# EasyEDA Pro project ProPrj_主板-智能视觉_2026-04-17.epro

# Schematic Schematic1
Board Name: Board1; Create Date: 2026-01-07; Page Name: P1; Project Name: 主板-智能视觉; Schematic Name: Schematic1; Update Date: 2026-04-12; Company: 嘉立创EDA; Page Size: A4; Version: V1.0
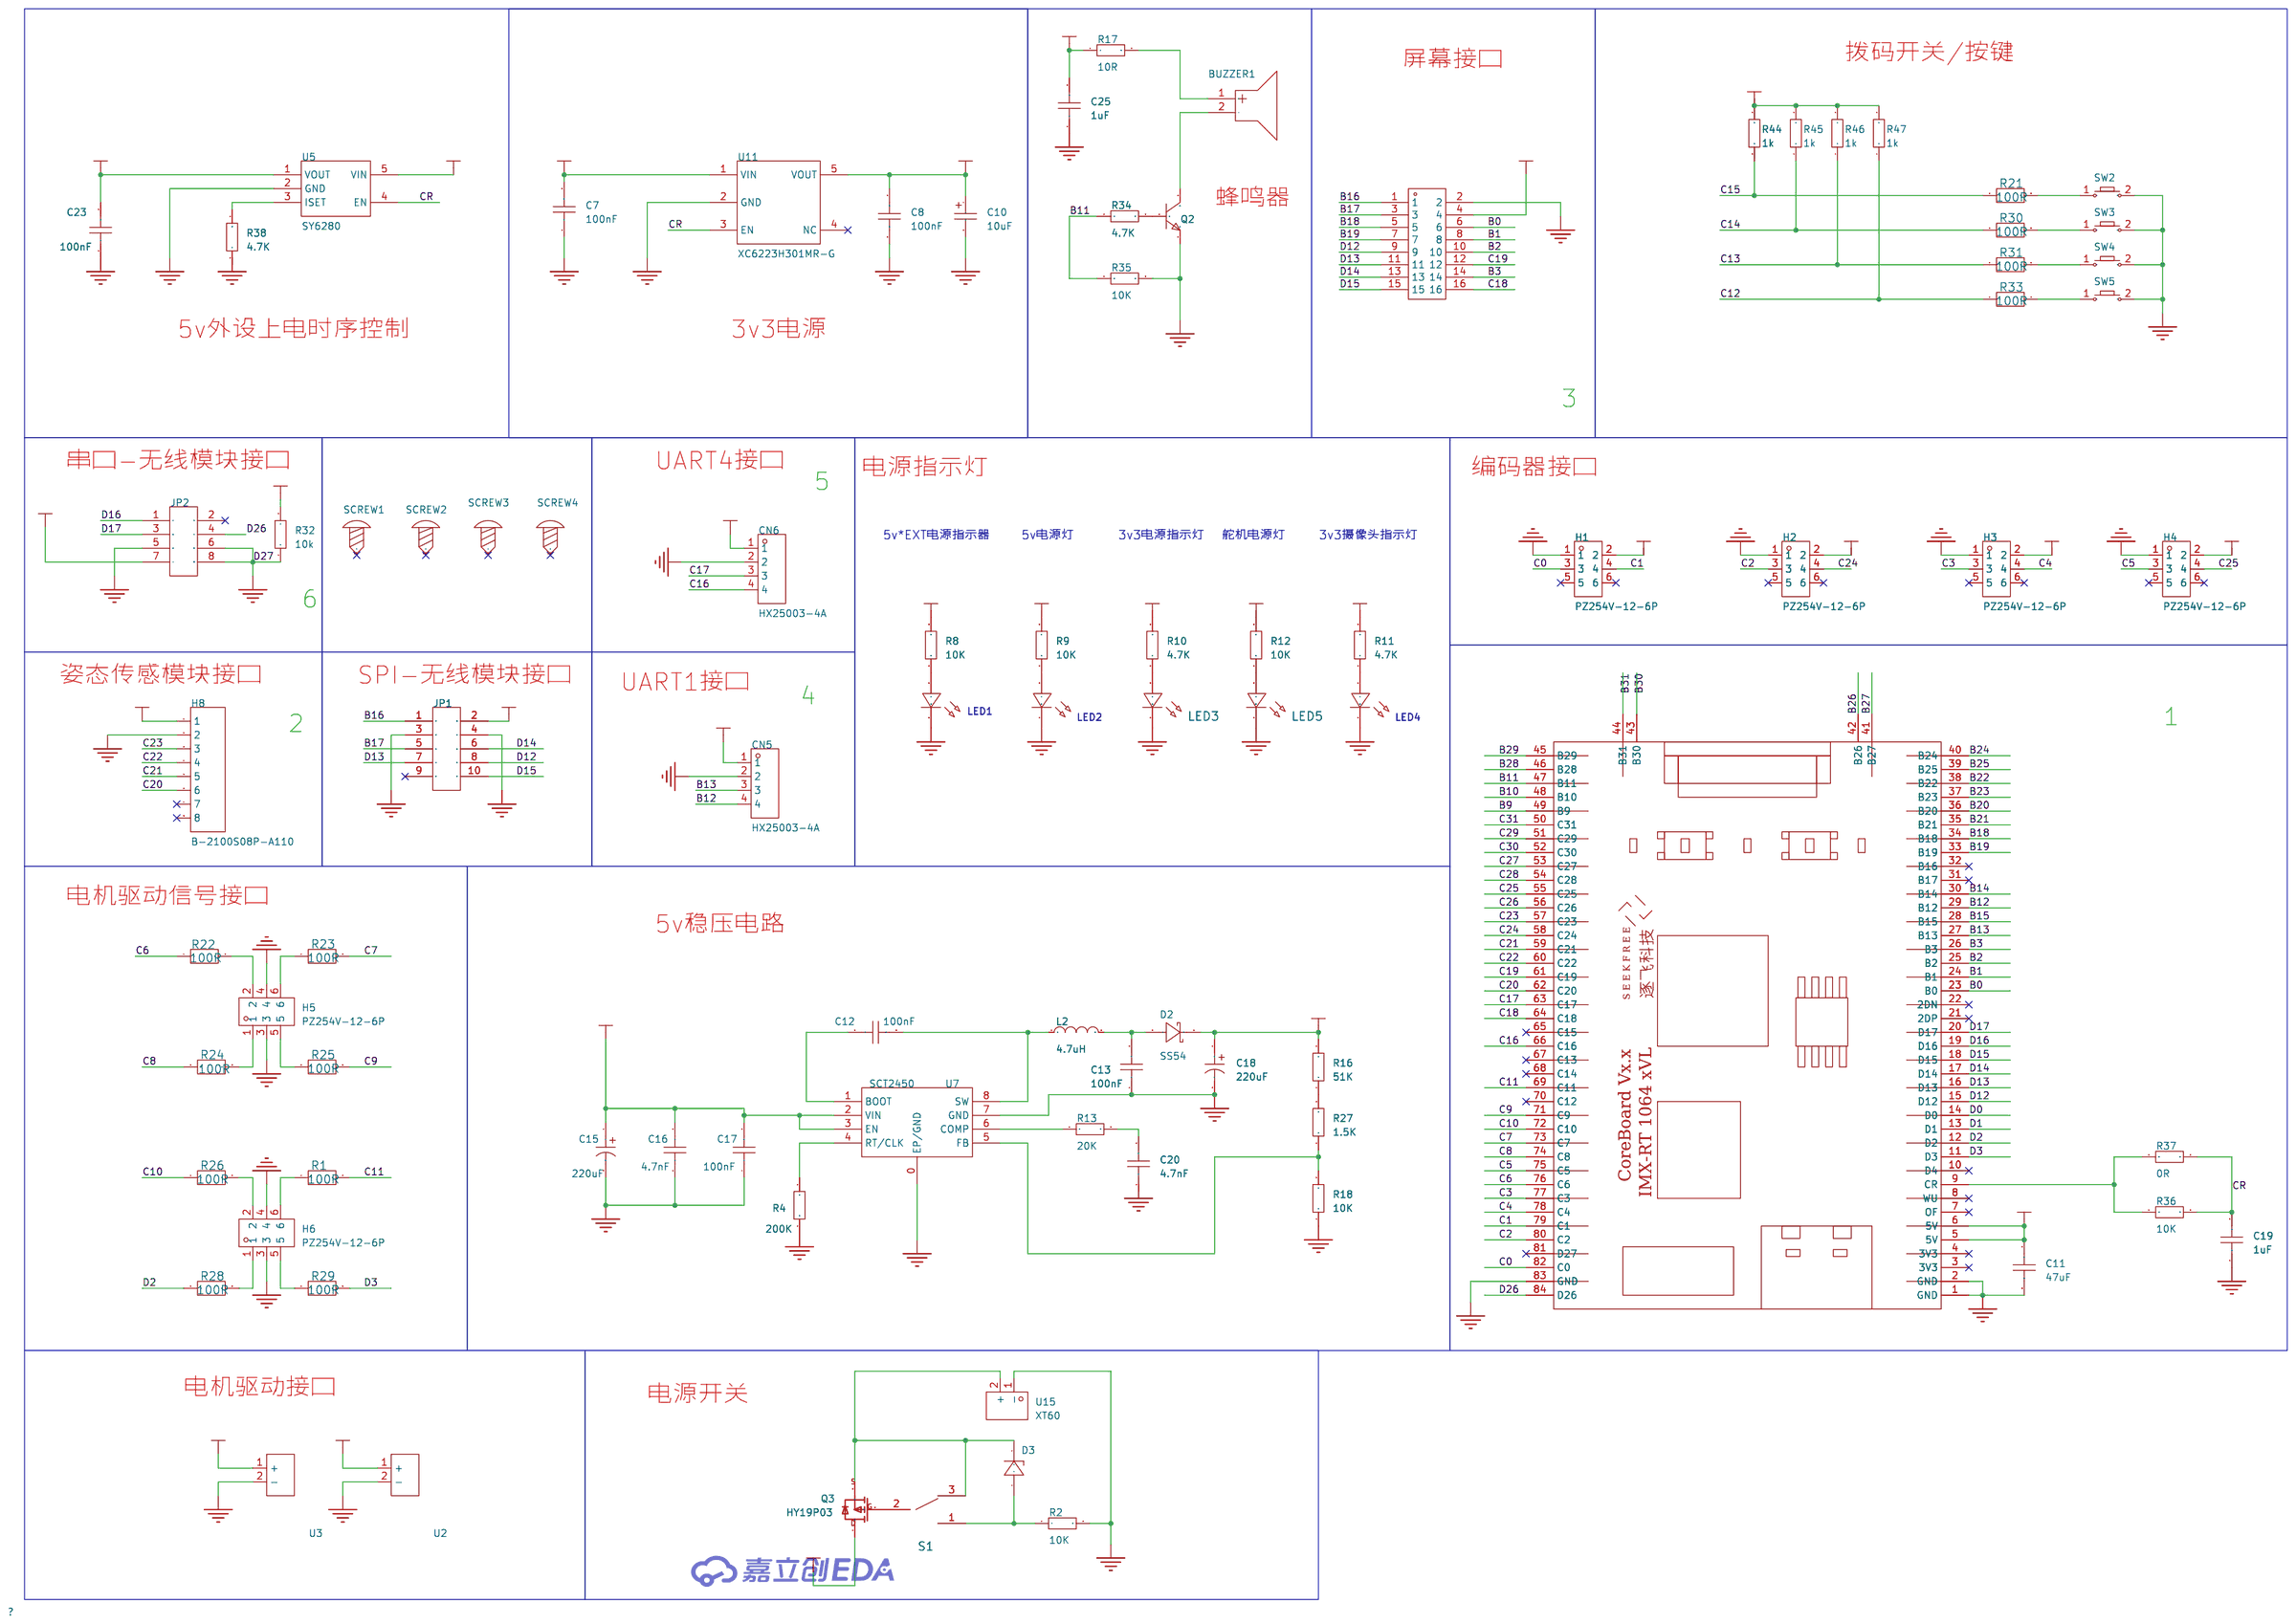
[diagram p0: schematic sheet]

## Parts
BUZZER1  5V,管脚间距8mm,外径10mm,高9.5mm  [BUZ-TH_BD12.0-P7.60-D0.6-FD]
C7  100nF  [C0603]
C8  100nF  [C0603]
C10  10uF  [CAP-SMD_L3.2-W1.6-RD-C7171]
C11  47uF  [C0603]
C12  100nF  [C0603]
C13  100nF  [C1206]
C15  220uF  [CAP-SMD_BD8.0-L8.3-W8.3-LS9.0-FD]
C16  4.7nF  [C1206]
C17  100nF  [C0603]
C18  220uF  [CAP-SMD_BD8.0-L8.3-W8.3-LS9.0-FD]
C19  1uF  [C0603]
C20  4.7nF  [C0603]
C23  100nF  [C0603]
C25  1uF  [C0603]
CN5  HX25003-4A  [CONN-TH_4P-P2.50_HX25003-4A]
CN6  HX25003-4A  [CONN-TH_4P-P2.50_HX25003-4A]
D2  SS54  [SMA_L4.2-W2.6-LS5.1-RD]
D3  BZT52C16  [SOD-123-L]
H1  PZ254V-12-6P  [HDR-TH_6P-P2.54-V-M-R2-C3-S2.54]
H2  PZ254V-12-6P  [HDR-TH_6P-P2.54-V-M-R2-C3-S2.54]
H3  PZ254V-12-6P  [HDR-TH_6P-P2.54-V-M-R2-C3-S2.54]
H4  PZ254V-12-6P  [HDR-TH_6P-P2.54-V-M-R2-C3-S2.54]
H5  PZ254V-12-6P  [HDR-TH_6P-P2.54-V-M-R2-C3-S2.54]
H6  PZ254V-12-6P  [HDR-TH_6P-P2.54-V-M-R2-C3-S2.54]
H7  8×2针双排母  [8×2针双排母_MSK_V1]
H8  B-2100S08P-A110  [HDR-TH_8P-P2.54-V-M]
JP1  2.54排母双排2*5P  [HDR2.54-LI-2x5P]
JP2  2.54排母双排2*4P  [HDR2.54-LI-2x4P]
L2  4.7uH  [IND-SMD_L7.1-W6.6_POHS0603]
LED1  -  [LED_0603]
LED2  -  [LED_0603]
LED3  -  [LED_0603]
LED4  -  [LED_0603]
LED5  -  [LED_0603]
Q2  -  [S8050_TO_92]
Q3  HY19P03  [TO-252AA]
R1  100R  [R0603]
R2  10K  [R0603]
R4  200K  [R0603]
R8  10K  [R0603]
R9  10K  [R0603]
R10  4.7K  [R0603]
R11  4.7K  [R0603]
R12  10K  [R0603]
R13  20K  [R0603]
R16  51K  [R0603]
R17  10R  [R0603]
R18  10K  [R0603]
R21  100R  [R0603]
R22  100R  [R0603]
R23  100R  [R0603]
R24  100R  [R0603]
R25  100R  [R0603]
R26  100R  [R0603]
R27  1.5K  [R0603]
R28  100R  [R0603]
R29  100R  [R0603]
R30  100R  [R0603]
R31  100R  [R0603]
R32  10k  [R0603]
R33  100R  [R0603]
R34  4.7K  [R0603]
R35  10K  [R0603]
R36  10K  [R0603]
R37  0R  [R0603]
R38  4.7K  [R0603]
R44  1k  [R0603]
R45  1k  [R0603]
R46  1k  [R0603]
R47  1k  [R0603]
S1  SW-SPDT  [SS12D10]
SCREW1  -  [M3螺丝]
SCREW2  -  [M3螺丝]
SCREW3  -  [M3螺丝]
SCREW4  -  [M3螺丝]
SW2  -  [Key_SMD_3x4x2]
SW3  -  [Key_SMD_3x4x2]
SW4  -  [Key_SMD_3x4x2]
SW5  -  [Key_SMD_3x4x2]
U2  -  [XT30]
U3  -  [XT30]
U5  SY6280  [SOT-23-5]
U7  SCT2450  [SOP-8E]
U11  XC6223H301MR-G  [SOT_235]
U15  XT60  [CONN-TH_XT60]
U?1  -  [AUFE_RT1064]

## Library data of the parts
BUZZER1 = 5V,管脚间距8mm,外径10mm,高9.5mm: Supplier Part: C9900017013; Supplier Footprint: BEEP; JLCPCB Part Class: 扩展库; Supplier: LCSC
C7 C8 C11 C12 C17 C19 C20 C23 C25 = CAP_0603: Supplier Footprint: 0603
C10 = TAJA106K016RNJ: 容值:10uF;精度:±10%;额定电压:16V;等效串联电阻(ESR):3Ω@100kHz;; LCSC Part Name: 10uF ±10% 16V; Supplier Part: C7171; Manufacturer: Kyocera AVX; Supplier Footprint: CASE-A-3216-18(mm); JLCPCB Part Class: 基础库; Supplier: LCSC; Tolerance: ±10%; Voltage Rating: 16V; Equivalent Series Resistance(ESR): 3Ω@100kHz; Operating Temperature: -55℃~+125℃
C13 C16 = CAP_1206: Supplier Footprint: 1206
C15 C18 = RYRVT25V220UF8*10: 容值:220uF;精度:±20%;额定电压:25V;纹波电流:183mA@120Hz;; LCSC Part Name: 220uF ±20% 25V; Supplier Part: C48970746; Manufacturer: HONOR(荣誉); Supplier Footprint: SMD,D8xL10.2mm; JLCPCB Part Class: 扩展库; Datasheet: https://item.szlcsc.com/datasheet/RYRVT25V220UF8*10/51295690.html; Supplier: LCSC; Tolerance: ±20%; Voltage Rating: 25V; Ripple Current: 183mA@120Hz; Diameter: 8mm; Height - Seated (Max): 10.2mm; Lifetime: 2000hrs@105℃; Operating Temperature: -55℃~+105℃
CN5 CN6 = HX25003-4A: 参考系列:XH;间距:2.5mm;插针结构:1x4P;排数:1;每排PIN数:4;行距:-;公母:公型插针;安装方式:直插;额定电流:-;工作温度范围:-;; LCSC Part Name: 母座 直插/直针 2.5mm 4Pin位; Supplier Part: C442301; Manufacturer: HX(红星); Supplier Footprint: 插件,P=2.5mm; JLCPCB Part Class: Extended Part; Datasheet: https://atta.szlcsc.com/upload/public/pdf/source/20191028/C442301_3A3D3A554E5F0CBC5D03B496CD495BC6.pdf; Supplier: LCSC; Reference Series: XH; Pitch: 2.5mm; Pins Structure: 1x4P; Number of Rows: 1; Number of PINs Per Row: 4; Gender: 公型插针; Mounting Style: 直插
D2 = SS54: Supplier Part: C9900023219; Supplier Footprint: (1N5824)DO-214; JLCPCB Part Class: 扩展库; Supplier: LCSC
D3 = BZT52C16: Published: 8-Jun-2000; Revision: July-2002: Re-released for DXP Platform.; Publisher: Altium Limited; Price(RMB): 0.000; Origin Footprint 2: DIODE-0.7; Origin Footprint 3: DIODE-0.4; Origin Footprint 4: SOD-87[LL-41]; Origin Footprint 5: CD4521-1808; Origin Footprint 6: SOD-80[LL-34]; Origin Footprint 7: SOD-123-FL; Origin Footprint 8: SOD-123-M; Origin Footprint 9: SOD-323; Origin Footprint 10: SOD-523-L; Origin Footprint 11: SOD-523-M
H1-H6 = PZ254V-12-6P: 插针结构:2x3P;间距:2.54mm;行距:2.54mm;圆针/方针:方针;安装类型:直插;排数:双排;总PIN位数:6P;额定电流:-;额定电压:-;配合针长度:6mm;塑高:2.5mm;端接针长度:3mm;触头材质:黄铜;触头镀层:-;工作温度范围:-40℃~+105℃;颜色:黑色;; LCSC Part Name: 间距:2.54mm 2x3P 直插 方针; Supplier Part: C492420; Manufacturer: XFCN(兴飞); Supplier Footprint: 插件,P=2.54mm; JLCPCB Part Class: 扩展库; Datasheet: https://atta.szlcsc.com/upload/public/pdf/source/20200309/C492420_BAECB307B001054C09D200388220EAE6.pdf; Supplier: LCSC; Pin Structure: 2x3P; Pitch: 2.54mm; Row Spacing: 2.54mm; Circluar Pins/Square Pins: 方针; Mounting Type: 直插; Number of Rows: 双排; Number of Pins: 6P; Length of Mating Pin: 6mm; Insulation Height: 2.5mm; Length of End Connection Pin: 3mm; Contact Material: 黄铜; Operating Temperature Range: -40℃~+105℃; Color: 黑色
H7 = 8×2针双排母
H8 = B-2100S08P-A110: 插针结构:1x8P;间距:2.54mm;行距:-;圆针/方针:方针;安装方式:直插;排数:单排;总PIN位数:8P;额定电流:3A;额定电压:-;配合针长度:6mm;塑高:2.54mm;端接针长度:3mm;触头材质:黄铜;触头镀层:-;工作温度:-40℃~+105℃;颜色:黑色;; LCSC Part Name: 1x8P 间距:2.54mm 方针 直插; Supplier Part: C124381; Manufacturer: Ckmtw(灿科盟); Supplier Footprint: 插件,P=2.54mm; JLCPCB Part Class: 扩展库; Datasheet: https://item.szlcsc.com/datasheet/B-2100S08P-A110/125656.html; Supplier: LCSC; Pin Structure: 1x8P; Pitch: 2.54mm; Circluar Pins/Square Pins: 方针; Mounting Type: 直插; Number of Rows: 单排; Number of Pins: 8P; Current Rating: 3A; Length of Mating Pin: 6mm; Insulation Height: 2.54mm; Length of End Connection Pin: 3mm; Contact Material: 黄铜; Operating Temperature: -40℃~+105℃; Color: 黑色
JP1 = 2.54排母双排2*5P
JP2 = 2.54排母双排2*4P
L2 = POHS0603-4R7M: 电感值:4.7uH;精度:±20%;额定电流:5A;饱和电流(Isat):8A;类型:一体成型电感;; LCSC Part Name: 功率电感; Supplier Part: C49333010; Manufacturer: HYHONGYEX(宏业); Supplier Footprint: SMD,7.1x6.6mm; JLCPCB Part Class: 扩展库; Datasheet: https://item.szlcsc.com/datasheet/POHS0603-4R7M/51817416.html; Supplier: LCSC; Tolerance: ±20%; Current Rating: 5A; Current - Saturation(Isat): 8A; DC Resistance(DCR): 40mΩ; Type: 一体成型电感
LED1 LED4 = LED_0603-G: Supplier Footprint: 0603
LED2 = LED_0603-B: Supplier Footprint: 0603
LED3 LED5 = LED_0603-R: Supplier Footprint: 0603
Q2 = S8050_TO_NPN: Supplier Footprint: TO-92
Q3 = HY19P03: HY19P03 P-Channel MOSFET; componentDisplayMode: -1
R1 R21-R26 R28-R31 R33 = 100R
R2 R4 R8-R13 R16-R18 R27 R34-R38 = Res_0603: Supplier Footprint: 0603
R32 R44-R47 = R-10K-1%: 电阻类型:厚膜电阻;阻值:10kΩ;精度:±1%;功率:100mW;工作电压:75V;温度系数:±100ppm/℃;; Manufacturer: UNI-ROYAL(厚声); Manufacturer Part: 0603WAF1002T5E; Supplier: LCSC; Supplier Part: C25804; LCSC Part Name: 厚膜电阻 10kΩ ±1% 100mW; Supplier Footprint: 0603; JLCPCB Part Class: Basic Part; Datasheet: https://atta.szlcsc.com/upload/public/pdf/source/20200306/C422600_1E6D84923E4A46A82E41ADD87F860B5C.pdf; Type: 厚膜电阻; Tolerance: ±1%; Power(Watts): 100mW; Voltage-Supply(Max): 75V; Temperature Coefficient: ±100ppm/℃; Operating Temperature: -55℃~+155℃
S1 = SW-SPDT: Published: 24-Mar-1999; Publisher: Altium Limited; Price(RMB): 0.000
SCREW1-SCREW4 = M3螺丝: Supplier Footprint: 插件
SW2-SW5 = Key_SMD_3x4x2: Supplier Footprint: SMD
U2 U3 = XT30
U5 = SY6280: Published: 2020-12-08; Revision: V1.0; Imax: 2.1A
U7 = SCT2450
U11 = XC6223H301MR-G: 存货编码: 1110404156; 存货名称: 集成电路
U15 = XT60: 模型锂电连接器; LCSC Part Name: XT60公头（电调端）; Supplier Part: C98733; Manufacturer: AMASS(艾迈斯); Supplier Footprint: XT60-M; JLCPCB Part Class: 扩展库; Datasheet: https://atta.szlcsc.com/upload/public/pdf/source/20170606/1496716524919.pdf; Supplier: LCSC
U?1 = RT1064: Supplier: seekfree

## Nets
3V3: C8.2 C10.1 C25.2 H1.2 H2.2 H3.2 H4.2 H7.4 H8.1 R10.2 R17.1 R32.2 R44.2 R45.2 R46.2 R47.2 U11.5(VOUT)
GND: C7.1 C8.1 C10.2 C11.2 C13.1 C15.2 C16.1 C17.1 C18.2 C19.1 C20.1 C23.1 C25.1 CN5.2 CN6.2 H1.1 H2.1 H3.1 H4.1 H5.3 H5.4 H6.3 H6.4 H7.2 H8.2 JP1.3 JP1.4 JP2.5 JP2.6 LED1.1(C) LED2.1(C) LED3.1(C) LED4.1(C) LED5.1(C) Q2.1(E) R2.2 R4.1 R18.1 R35.2 R38.1 SW2.2 SW3.2 SW4.2 SW5.2 U2.2(-) U3.2(-) U5.2(GND) U7.0(EP/GND) U7.7(GND) U11.2(GND) U15.1(-) U?1.1(GND) U?1.2(GND) U?1.83(GND)
VCC-5V: C7.2 C11.1 C18.1 D2.1(C) R9.2 R16.2 U5.5(VIN) U11.1(VIN) U?1.5(5V) U?1.6(5V)
VCC-5V-EXT: C23.2 CN5.1 CN6.1 JP1.2 JP2.7 R8.2 U5.1(VOUT)
VCC_SERVO: R12.2
VCCBAT: C15.1 C16.2 C17.2 Q3.1(D) U2.1(+) U3.1(+) U7.2(VIN) U7.3(EN)
B0: H7.6 U?1.23(B0)
B1: H7.8 U?1.24(B1)
B2: H7.10 U?1.25(B2)
B3: H7.14 U?1.26(B3)
B9: U?1.49(B9)
B10: U?1.48(B10)
B11: R34.1 R35.1 U?1.47(B11)
B12: CN5.4 U?1.29(B12)
B13: CN5.3 U?1.27(B13)
B14: U?1.30(B14)
B15: U?1.28(B15)
B16: H7.1 JP1.1
B17: H7.3 JP1.5
B18: H7.5 U?1.34(B18)
B19: H7.7 U?1.33(B19)
B20: U?1.36(B20)
B21: U?1.35(B21)
B22: U?1.38(B22)
B23: U?1.37(B23)
B24: U?1.40(B24)
B25: U?1.39(B25)
B26: U?1.42(B26)
B27: U?1.41(B27)
B28: U?1.46(B28)
B29: U?1.45(B29)
B30: U?1.43(B30)
B31: U?1.44(B31)
C0: H1.3 U?1.82(C0)
C1: H1.4 U?1.79(C1)
C2: H2.3 U?1.80(C2)
C3: H3.3 U?1.77(C3)
C4: H3.4 U?1.78(C4)
C5: H4.3 U?1.75(C5)
C6: R22.1 U?1.76(C6)
C7: R23.2 U?1.73(C7)
C8: R24.1 U?1.74(C8)
C9: R25.2 U?1.71(C9)
C10: R26.1 U?1.72(C10)
C11: R1.2 U?1.69(C11)
C12: R33.1 R47.1
C13: R31.1 R46.1
C14: R30.1 R45.1
C15: R21.1 R44.1
C16: CN6.4 U?1.66(C16)
C17: CN6.3 U?1.63(C17)
C18: H7.16 U?1.64(C18)
C19: H7.12 U?1.61(C19)
C20: H8.6 U?1.62(C20)
C21: H8.5 U?1.59(C21)
C22: H8.4 U?1.60(C22)
C23: H8.3 U?1.57(C23)
C24: H2.4 U?1.58(C24)
C25: H4.4 U?1.55(C25)
C26: U?1.56(C26)
C27: U?1.53(C27)
C28: U?1.54(C28)
C29: U?1.51(C29)
C30: U?1.52(C30)
C31: U?1.50(C31)
CR: C19.2 R36.2 R37.2 U5.4(EN) U11.3(EN)
CSI-3V3: R11.2
D0: U?1.14(D0)
D1: U?1.13(D1)
D2: R28.1 U?1.12(D2)
D3: R29.2 U?1.11(D3)
D12: H7.9 JP1.8 U?1.15(D12)
D13: H7.11 JP1.7 U?1.16(D13)
D14: H7.13 JP1.6 U?1.17(D14)
D15: H7.15 JP1.10 U?1.18(D15)
D16: JP2.1 U?1.19(D16)
D17: JP2.3 U?1.20(D17)
D26: JP2.4 U?1.84(D26)
D27: JP2.8 R32.1
$1N3992: R21.2 SW2.1
$1N3996: R30.2 SW3.1
$1N4004: R31.2 SW4.1
$1N4009: R33.2 SW5.1
$1N8072: R38.2 U5.3(ISET)
$1N10416: R4.2 U7.4(RT/CLK)
$1N10423: C12.1 U7.1(BOOT)
$1N10427: C12.2 L2.1 U7.8(SW)
$1N10446: C20.2 R13.2
$1N10453: R18.2 R27.1 U7.5(FB)
$1N10461: R13.1 U7.6(COMP)
$1N10501: R16.1 R27.2
$1N10556: C13.2 D2.2(A) L2.2
$1N13494: BUZZER1.1(+) R17.2
$1N13753: Q2.2(B) R34.2
$1N13767: BUZZER1.2(-) Q2.3(C)
$1N14655: D3.A R2.1 S1.1
$1N20848: R36.1 R37.1 U?1.9(CR)
$1N26305: Q3.2(G) S1.2
Net-(D3-K): D3.K Q3.3(S) S1.3 U15.2(+)
Net-(H5-1): H5.1 R24.2
Net-(H5-2): H5.2 R22.2
Net-(H5-5): H5.5 R25.1
Net-(H5-6): H5.6 R23.1
Net-(H6-1): H6.1 R28.2
Net-(H6-2): H6.2 R26.2
Net-(H6-5): H6.5 R29.1
Net-(H6-6): H6.6 R1.1
Net-(LED1-2): LED1.2(A) R8.1
Net-(LED2-2): LED2.2(A) R9.1
Net-(LED3-2): LED3.2(A) R10.1
Net-(LED4-2): LED4.2(A) R11.1
Net-(LED5-2): LED5.2(A) R12.1

Not connected (* = marked no-connect by the designer): H1 5* 6*; H2 5* 6*; H3 5* 6*; H4 5* 6*; H8 7* 8*; JP1 9*; JP2 2*; SCREW1 1*; SCREW2 1*; SCREW3 1*; SCREW4 1*; U11 4(NC)*; U?1 3(3V3)* 4(3V3)* 7(OF)* 8(WU)* 10(D4)* 21(2DP)* 22(2DN)* 31(B17)* 32(B16)* 65(C15)* 67(C13)* 68(C14)* 70(C12)* 81(D27)*

## Notes on the sheet
- 拨码开关/按键
- 屏幕接口
- 蜂鸣器
- 5v外设上电时序控制
- 3v3电源
- 3
- 串口-无线模块接口
- UART4接口
- 电源指示灯
- 编码器接口
- 5
- 5v*EXT电源指示器
- 5v电源灯
- 3v3电源指示灯
- 舵机电源灯
- 3v3摄像头指示灯
- 6
- 姿态传感模块接口
- SPI-无线模块接口
- UART1接口
- 4
- 2
- 1
- 电机驱动信号接口
- 5v稳压电路
- 电机驱动接口
- 电源开关

# Board PCB1
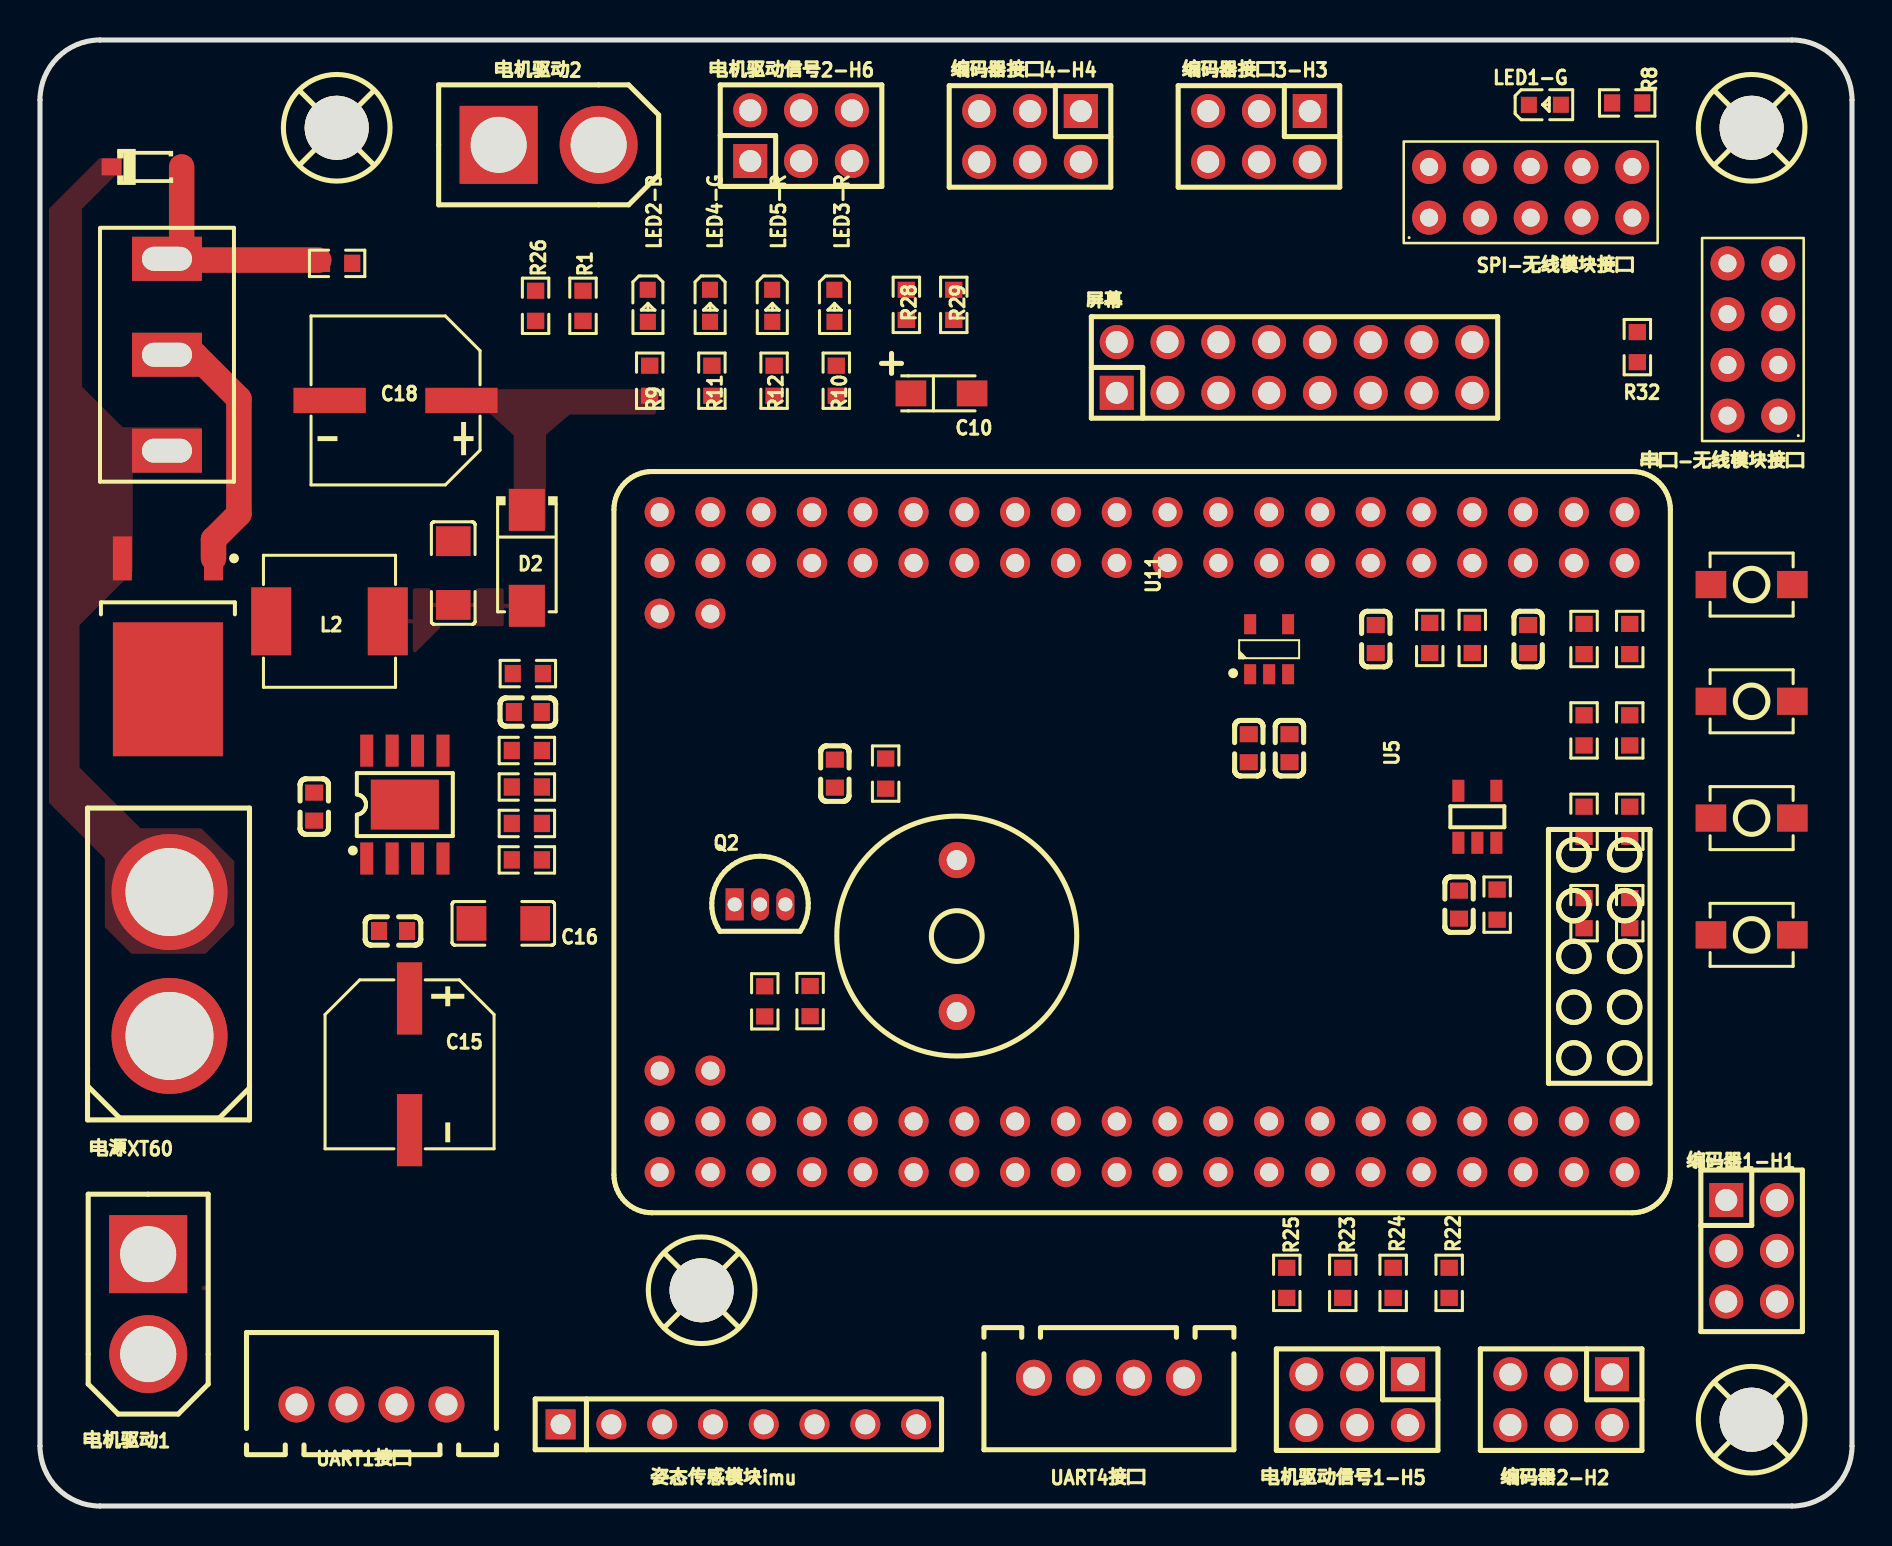
[diagram p1: board, top side]
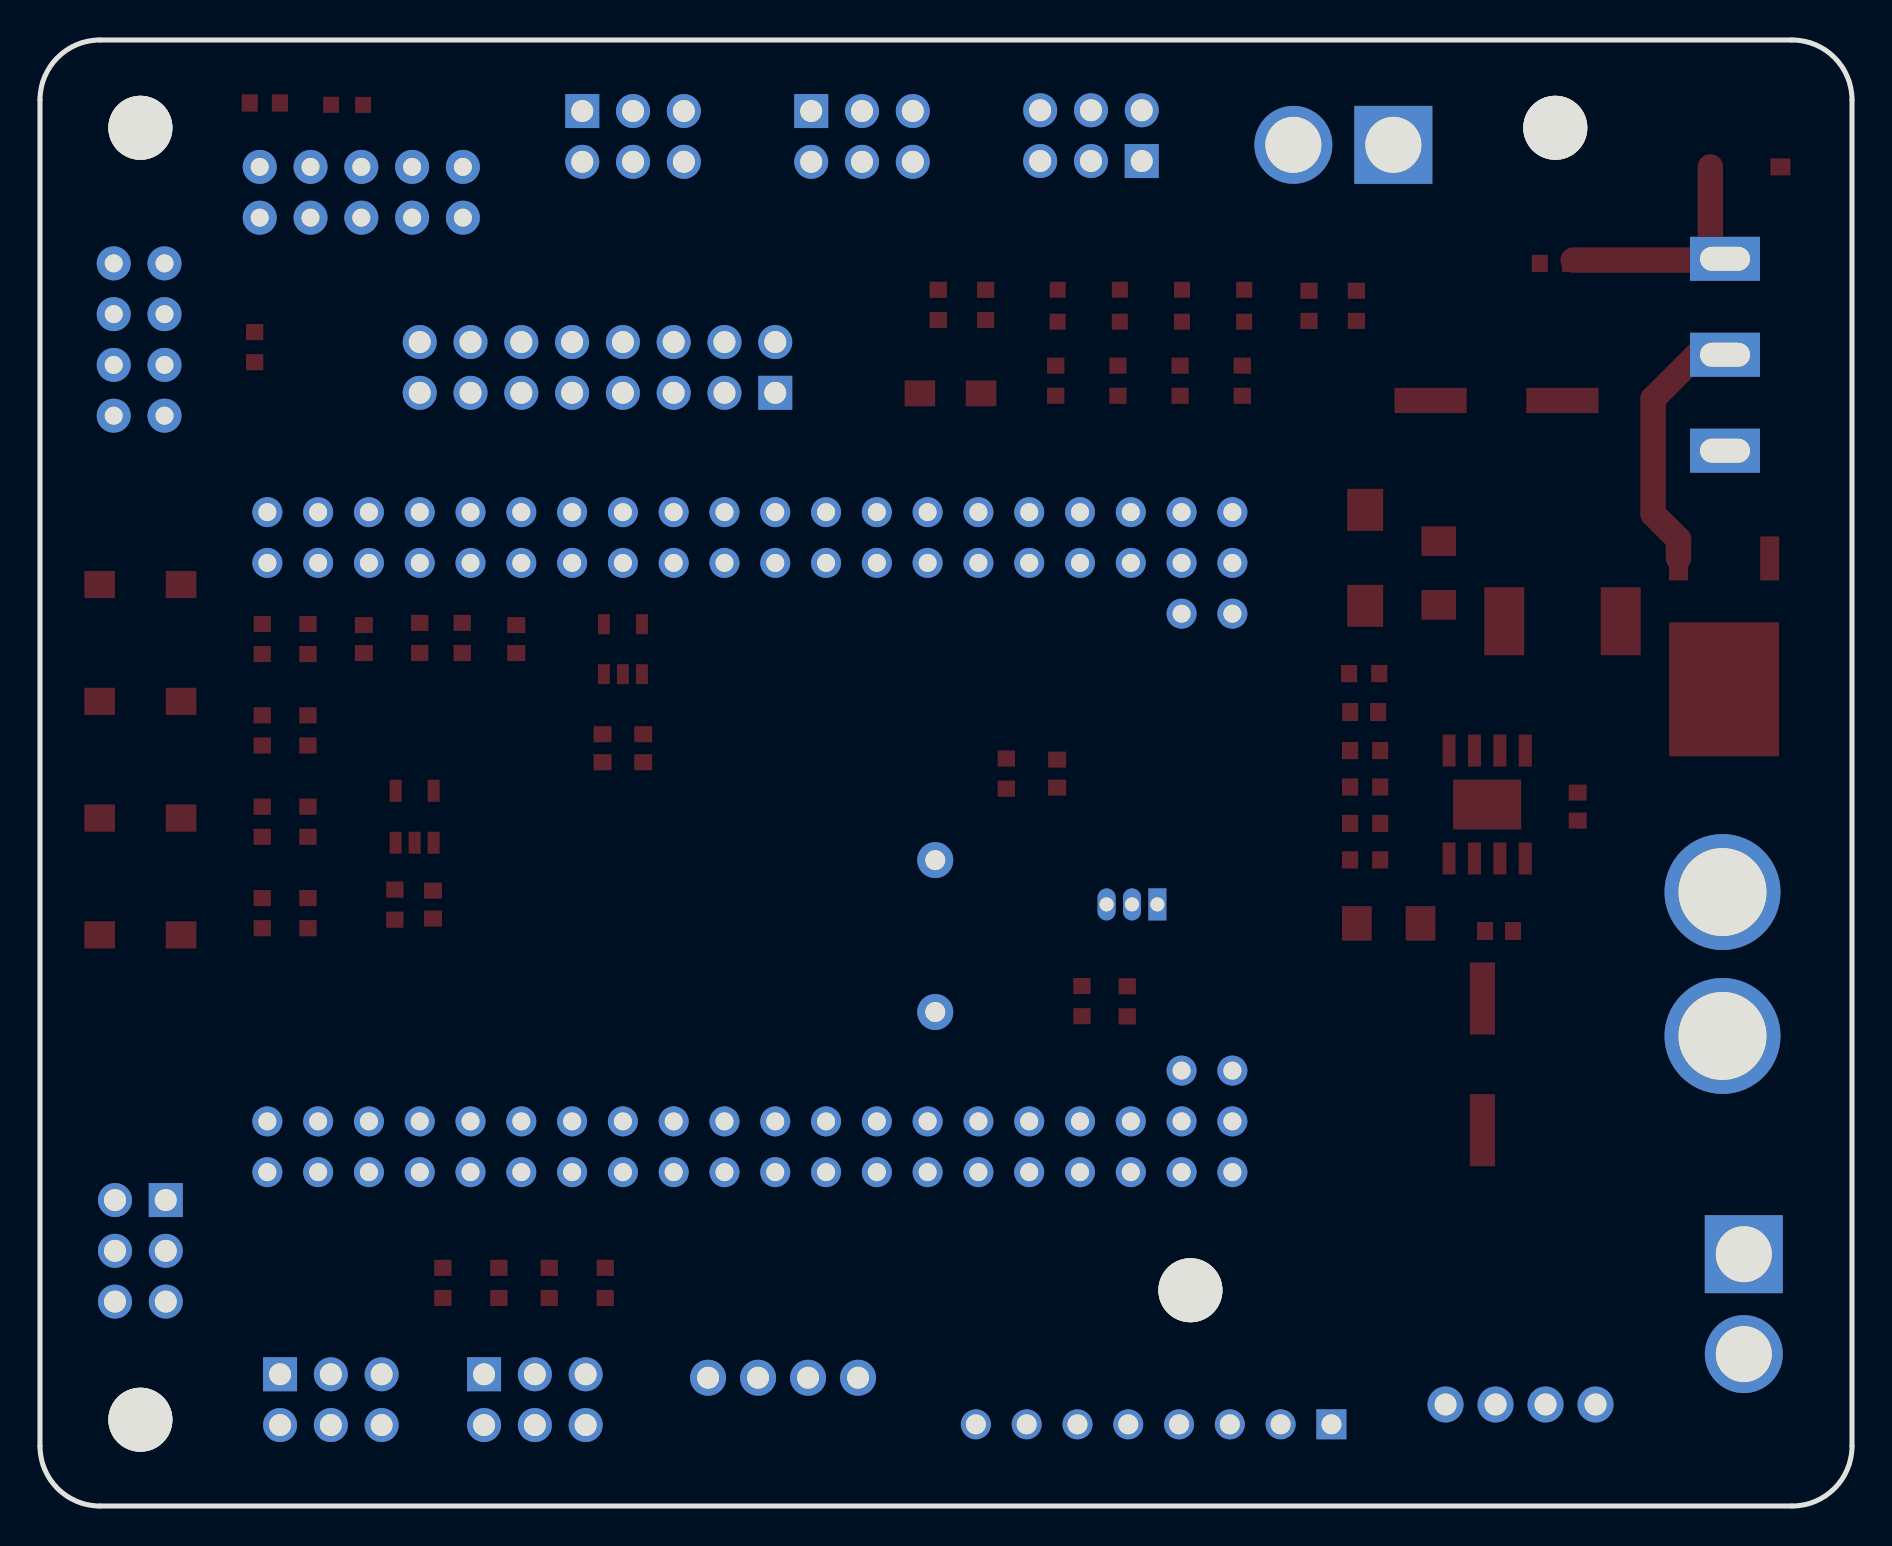
[diagram p2: board, bottom side, seen from below]

Outline 90.62 x 73.35 mm; copper layers: Top Layer, 电源层, GND层, Bottom Layer. Coordinates in mm from the lower left corner of the outline.
Outline path: 0,70.35 0,3 arc(0.88,0.88) 3,0 87.62,0 arc(89.74,0.88) 90.62,3 90.62,70.35 arc(89.74,72.47) 87.62,73.35 3,73.35 arc(0.88,72.47) 0,70.35
Stack: Top Layer 0.035mm 外层铜厚1oz / Dielectric1 0.2104mm 7628 RC49% 8.6mil / 电源层 0.0152mm 内层铜厚 / Dielectric2 1.065mm 1.1mm H/HOZ Copper / GND层 0.0152mm 内层铜厚 / Dielectric3 0.2104mm 7628 RC49% 8.6mil / Bottom Layer 0.035mm 外层铜厚1oz

## Design rules (mm)
template: 自定义配置
spacing copperThickness1oz (default): track to track 0.102, other pairs 0.152 to 0.3
spacing copperThickness2oz: track to track 0.203, other pairs 0.152 to 0.3
track width copperThickness1oz (default): min 0.127, default 0.254, max 2.54
track width copperThickness2oz: min 0.203, default 0.254, max 2.54
differential pair differentialPair (default): width min 0.127, default 0.254, max 2.54; gap min 0.152, default 0.152
via viaSize (default): diameter min 0.5, default 0.61, max 10; hole min 0.3, default 0.305, max 6.3
net VCCBAT uses copperRegion1
net VCC-5V uses copperRegion1
net $1N14471 uses copperRegion1

## Placement (name value [footprint] x y rotation side)
BUZZER1  5V,管脚间距8mm,外径10mm,高9.5mm  [BUZ-TH_BD12.0-P7.60-D0.6-FD]  45.85 28.52 270 top
C7  100nF  [C0603]  60.45 37.91 90 top
C8  100nF  [C0603]  62.48 37.91 90 top
C10  10uF  [CAP-SMD_L3.2-W1.6-RD-C7171]  45.09 55.67 0 top
C11  47uF  [C0603]  74.42 43.37 270 top
C12  100nF  [C0603]  13.72 34.99 90 top
C13  100nF  [C1206]  20.67 46.68 270 top
C15  220uF  [CAP-SMD_BD8.0-L8.3-W8.3-LS9.0-FD]  18.48 22.1 270 top
C16  4.7nF  [C1206]  23.17 29.15 180 top
C17  100nF  [C0603]  17.65 28.77 0 top
C18  220uF  [CAP-SMD_BD8.0-L8.3-W8.3-LS9.0-FD]  17.78 55.31 180 top
C19  1uF  [C0603]  66.8 43.37 270 top
C20  4.7nF  [C0603]  24.4 39.72 0 top
C23  100nF  [C0603]  70.97 30.09 90 top
C25  1uF  [C0603]  39.75 36.64 90 top
D2  SS54  [SMA_L4.2-W2.6-LS5.1-RD]  24.35 47.44 270 top
D3  BZT52C16  [SOD-123-L]  5.33 67 180 top
L2  4.7uH  [IND-SMD_L7.1-W6.6_POHS0603]  14.48 44.26 0 top
LED1-G  -  [LED_0603]  75.31 70.11 0 top
LED2-B  -  [LED_0603]  30.4 60 270 top
LED3-R  -  [LED_0603]  39.73 60 270 top
LED4-G  -  [LED_0603]  33.51 60 270 top
LED5-R  -  [LED_0603]  36.62 60 270 top
Q2  -  [S8050_TO_92]  36.01 30.1 0 top
Q3  HY19P03  [TO-252AA]  6.4 44.14 270 top
R1  100R  [R0603]  27.16 60.05 270 top
R2  10K  [R0603]  14.86 62.17 0 top
R4  200K  [R0603]  24.35 32.33 180 top
R8  10K  [R0603]  79.38 70.2 0 top
R9  10K  [R0603]  30.49 56.3 270 top
R10  4.7K  [R0603]  39.82 56.3 270 top
R11  4.7K  [R0603]  33.6 56.3 270 top
R12  10K  [R0603]  36.71 56.3 270 top
R13  20K  [R0603]  24.4 41.65 0 top
R16  51K  [R0603]  24.35 37.8 0 top
R17  10R  [R0603]  42.29 36.64 270 top
R18  10K  [R0603]  24.35 34.15 180 top
R21  100R  [R0603]  79.5 43.38 270 top
R22  100R  [R0603]  70.47 11.16 270 top
R23  100R  [R0603]  65.15 11.16 90 top
R24  100R  [R0603]  67.67 11.16 270 top
R25  100R  [R0603]  62.35 11.16 90 top
R26  100R  [R0603]  24.78 60.05 90 top
R27  1.5K  [R0603]  24.35 35.97 0 top
R28  100R  [R0603]  43.33 60.09 90 top
R29  100R  [R0603]  45.7 60.09 270 top
R30  100R  [R0603]  79.5 38.8 270 top
R31  100R  [R0603]  79.5 34.23 270 top
R32  10k  [R0603]  79.88 57.98 270 top
R33  100R  [R0603]  79.5 29.66 270 top
R34  4.7K  [R0603]  36.25 25.25 90 top
R35  10K  [R0603]  38.51 25.26 90 top
R36  10K  [R0603]  69.5 43.43 270 top
R37  0R  [R0603]  71.63 43.43 270 top
R38  4.7K  [R0603]  72.87 30.09 90 top
R44  1k  [R0603]  77.22 43.38 270 top
R45  1k  [R0603]  77.22 38.8 270 top
R46  1k  [R0603]  77.22 34.23 270 top
R47  1k  [R0603]  77.22 29.66 270 top
S1  SW-SPDT  [SS12D10]  6.35 57.6 270 top
SCREW1  -  [M3螺丝]  33.09 10.8 0 top
SCREW2  -  [M3螺丝]  85.6 4.32 0 top
SCREW3  -  [M3螺丝]  14.84 68.95 0 top
SCREW4  -  [M3螺丝]  85.6 68.95 0 top
SPI-无线模块接口  2.54排母双排2*5P  [HDR2.54-LI-2x5P]  74.55 65.73 0 top
SW2  -  [Key_SMD_3x4x2]  85.6 46.1 0 top
SW3  -  [Key_SMD_3x4x2]  85.6 40.26 0 top
SW4  -  [Key_SMD_3x4x2]  85.6 34.42 0 top
SW5  -  [Key_SMD_3x4x2]  85.6 28.58 0 top
U5  SY6280  [SOT-23-5]  71.88 34.48 90 top
U7  SCT2450  [SOP-8E]  18.25 35.09 90 top
U11  XC6223H301MR-G  [SOT_235]  61.47 42.87 90 top
U?1  -  [AUFE_RT1064]  55.12 33.21 180 top
UART1接口  HX25003-4A  [CONN-TH_4P-P2.50_HX25003-4A]  16.58 5.08 180 top
UART4接口  HX25003-4A  [CONN-TH_4P-P2.50_HX25003-4A]  53.46 6.42 0 top
串口-无线模块接口  2.54排母双排2*4P  [HDR2.54-LI-2x4P]  85.66 58.36 90 top
姿态传感模块imu  B-2100S08P-A110  [HDR-TH_8P-P2.54-V-M]  34.93 4.09 0 top
屏幕  8×2针双排母  [8×2针双排母_MSK_V1]  62.74 56.96 0 top
电机驱动1  -  [XT30]  5.41 10.1 270 top
电机驱动2  -  [XT30]  25.44 68.1 0 top
电机驱动信号1-H5  PZ254V-12-6P  [HDR-TH_6P-P2.54-V-M-R2-C3-S2.54]  65.87 5.32 180 top
电机驱动信号2-H6  PZ254V-12-6P  [HDR-TH_6P-P2.54-V-M-R2-C3-S2.54]  38.06 68.56 0 top
电源XT60  XT60  [CONN-TH_XT60]  6.48 27.12 90 top
编码器1-H1  PZ254V-12-6P  [HDR-TH_6P-P2.54-V-M-R2-C3-S2.54]  85.6 12.77 270 top
编码器2-H2  PZ254V-12-6P  [HDR-TH_6P-P2.54-V-M-R2-C3-S2.54]  76.07 5.32 180 top
编码器接口3-H3  PZ254V-12-6P  [HDR-TH_6P-P2.54-V-M-R2-C3-S2.54]  60.96 68.52 180 top
编码器接口4-H4  PZ254V-12-6P  [HDR-TH_6P-P2.54-V-M-R2-C3-S2.54]  49.51 68.52 180 top

## Footprints (pads in the part's own frame, mm; a bottom-side part is the same pattern mirrored in y, then rotated)
8×2针双排母_MSK_V1
  rect 1.7x1.7 hole 1.1: 1(-8.89,-1.27)
  round 1.7 hole 1.1: 2(-8.89,1.27) 3(-6.35,-1.27) 4(-6.35,1.27) 5(-3.81,-1.27) 6(-3.81,1.27) 7(-1.27,-1.27) 8(-1.27,1.27) 9(1.27,-1.27) 10(1.27,1.27) 11(3.81,-1.27) 12(3.81,1.27) 13(6.35,-1.27) 14(6.35,1.27) 15(8.89,-1.27) 16(8.89,1.27)
AUFE_RT1064
  round 1.5 hole 0.9: 1(-24.13,-16.51) 2(-24.13,-13.97) 3(-21.59,-16.51) 4(-21.59,-13.97) 5(-19.05,-16.51) 6(-19.05,-13.97) 7(-16.51,-16.51) 8(-16.51,-13.97) 9(-13.97,-16.51) 10(-13.97,-13.97) 11(-11.43,-16.51) 12(-11.43,-13.97) 13(-8.89,-16.51) 14(-8.89,-13.97) 15(-6.35,-16.51) 16(-6.35,-13.97) 17(-3.81,-16.51) 18(-3.81,-13.97) 19(-1.27,-16.51) 20(-1.27,-13.97) 21(1.27,-16.51) 22(1.27,-13.97) 23(3.81,-16.51) 24(3.81,-13.97) 25(6.35,-16.51) 26(6.35,-13.97) 27(8.89,-16.51) 28(8.89,-13.97) 29(11.43,-16.51) 30(11.43,-13.97) 31(13.97,-16.51) 32(13.97,-13.97) 33(16.51,-16.51) 34(16.51,-13.97) 35(19.05,-16.51) 36(19.05,-13.97) 37(21.59,-16.51) 38(21.59,-13.97) 39(24.13,-16.51) 40(24.13,-13.97) 41(21.59,-11.43) 42(24.13,-11.43) 43(24.13,11.43) 44(21.59,11.43) 45(24.13,13.97) 46(24.13,16.51) 47(21.59,13.97) 48(21.59,16.51) 49(19.05,13.97) 50(19.05,16.51) 51(16.51,13.97) 52(16.51,16.51) 53(13.97,13.97) 54(13.97,16.51) 55(11.43,13.97) 56(11.43,16.51) 57(8.89,13.97) 58(8.89,16.51) 59(6.35,13.97) 60(6.35,16.51) 61(3.81,13.97) 62(3.81,16.51) 63(1.27,13.97) 64(1.27,16.51) 65(-1.27,13.97) 66(-1.27,16.51) 67(-3.81,13.97) 68(-3.81,16.51) 69(-6.35,13.97) 70(-6.35,16.51) 71(-8.89,13.97) 72(-8.89,16.51) 73(-11.43,13.97) 74(-11.43,16.51) 75(-13.97,13.97) 76(-13.97,16.51) 77(-16.51,13.97) 78(-16.51,16.51) 79(-19.05,13.97) 80(-19.05,16.51) 81(-21.59,13.97) 82(-21.59,16.51) 83(-24.13,13.97) 84(-24.13,16.51)
BUZ-TH_BD12.0-P7.60-D0.6-FD
  round 1.8 hole 1: 1(-3.8,0) 2(3.8,0)
C0603
  rect 0.8x0.9 smd: 1(-0.7,0) 2(0.7,0)
C1206
  rect 1.485x1.728 smd: 1(-1.593,0) 2(1.593,0)
CAP-SMD_BD8.0-L8.3-W8.3-LS9.0-FD
  rect 3.61x1.26 smd: 1(-3.295,0) 2(3.295,0)
CAP-SMD_L3.2-W1.6-RD-C7171
  rect 1.53x1.296 smd: 1(-1.53,0) 2(1.53,0)
CONN-TH_4P-P2.50_HX25003-4A
  round 1.8 hole 1.1: 1(-3.75,0) 2(-1.25,0) 3(1.25,0) 4(3.75,0)
CONN-TH_XT60
  round 5.8 hole 4.4: 1(-3.6,0) 2(3.6,0)
HDR2.54-LI-2x4P
  round 1.7 hole 0.9: 1(-3.81,-1.27) 2(-3.81,1.27) 3(-1.27,-1.27) 4(-1.27,1.27) 5(1.27,-1.27) 6(1.27,1.27) 7(3.81,-1.27) 8(3.81,1.27)
HDR2.54-LI-2x5P
  round 1.7 hole 0.9: 1(-5.08,-1.27) 2(-5.08,1.27) 3(-2.54,-1.27) 4(-2.54,1.27) 5(0,-1.27) 6(0,1.27) 7(2.54,-1.27) 8(2.54,1.27) 9(5.08,-1.27) 10(5.08,1.27)
HDR-TH_6P-P2.54-V-M-R2-C3-S2.54
  rect 1.7x1.7 hole 1.1: 1(-2.54,-1.27)
  round 1.7 hole 1.1: 2(-2.54,1.27) 3(0,-1.27) 4(0,1.27) 5(2.54,-1.27) 6(2.54,1.27)
HDR-TH_8P-P2.54-V-M
  rect 1.5x1.5 hole 1: 1(-8.89,0)
  round 1.5 hole 1: 2(-6.35,0) 3(-3.81,0) 4(-1.27,0) 5(1.27,0) 6(3.81,0) 7(6.35,0) 8(8.89,0)
IND-SMD_L7.1-W6.6_POHS0603
  rect 2x3.4 smd: 1(-2.913,0) 2(2.913,0)
Key_SMD_3x4x2
  rect 1.53x1.36 smd: 1(-2.035,0) 2(2.035,0)
LED_0603
  rect 0.8x0.8 smd: 1(-0.851,-0.01) 2(0.75,-0.005)
M3螺丝
  round 3.2 hole 3.2: 1(0,0)
R0603
  rect 0.806x0.864 smd: 1(-0.753,0) 2(0.753,0)
S8050_TO_92
  rect 0.899x1.6 hole 0.701: 1(-1.27,0)
  oval 0.899x1.6 hole 0.701: 2(0,0) 3(1.27,0)
SMA_L4.2-W2.6-LS5.1-RD
  rect 2.1x1.8 smd: 1(-2.4,0) 2(2.4,0)
SOD-123-L
  rect 1x0.85 smd: A(-1.75,0) K(1.75,0)
SOP-8E
  rect 2.5x3.4 smd: 0(0,0)
  rect 1.6x0.65 smd: 1(-2.7,1.905) 2(-2.7,0.635) 3(-2.7,-0.635) 4(-2.7,-1.905) 5(2.7,-1.905) 6(2.7,-0.635) 7(2.7,0.635) 8(2.7,1.905)
SOT-23-5
  rect 1.1x0.6 smd: 1(-1.3,0.95) 2(-1.3,0) 3(-1.3,-0.95) 4(1.3,-0.95) 5(1.3,0.95)
SOT_235
  rect 1x0.6 smd: 1(-1.25,0.95) 2(-1.25,0) 3(-1.25,-0.95) 4(1.25,-0.95) 5(1.25,0.95)
SS12D10
  rect 2.2x3.5 hole 1.2x2.5: 1(-4.8,0) 2(0,0) 3(4.8,0)
TO-252AA
  rect 6.7x5.5 smd: 1(3.275,0)
  rect 2.2x0.95 smd: 2(-3.275,2.28) 3(-3.275,-2.28)
XT30
  rect 3.9x3.9 hole 2.8: 1(-2.5,0)
  round 3.9 hole 2.8: 2(2.5,0)

## Nets
3V3: C8.2 C10.1 C25.2 R10.2 R17.1 R32.2 R44.2 R45.2 R46.2 R47.2 U11.5 姿态传感模块imu.1 屏幕.4 编码器1-H1.2 编码器2-H2.2 编码器接口3-H3.2 编码器接口4-H4.2
GND: C7.1 C8.1 C10.2 C11.2 C13.1 C15.2 C16.1 C17.1 C18.2 C19.1 C20.1 C23.1 C25.1 LED1-G.1 LED2-B.1 LED3-R.1 LED4-G.1 LED5-R.1 Q2.1 R2.2 R4.1 R18.1 R35.2 R38.1 SPI-无线模块接口.3 SPI-无线模块接口.4 SW2.2 SW3.2 SW4.2 SW5.2 U5.2 U7.0 U7.7 U11.2 U?1.1 U?1.2 U?1.83 UART1接口.2 UART4接口.2 串口-无线模块接口.5 串口-无线模块接口.6 姿态传感模块imu.2 屏幕.2 电机驱动1.2 电机驱动2.2 电机驱动信号1-H5.3 电机驱动信号1-H5.4 电机驱动信号2-H6.3 电机驱动信号2-H6.4 电源XT60.1 编码器1-H1.1 编码器2-H2.1 编码器接口3-H3.1 编码器接口4-H4.1
VCC-5V: C7.2 C11.1 C18.1 D2.1 R9.2 R16.2 U5.5 U11.1 U?1.5 U?1.6
VCC-5V-EXT: C23.2 R8.2 SPI-无线模块接口.2 U5.1 UART1接口.1 UART4接口.1 串口-无线模块接口.7
VCC_SERVO: R12.2
VCCBAT: C15.1 C16.2 C17.2 Q3.1 U7.2 U7.3 电机驱动1.1 电机驱动2.1
B0: U?1.23 屏幕.6
B1: U?1.24 屏幕.8
B2: U?1.25 屏幕.10
B3: U?1.26 屏幕.14
B9: U?1.49
B10: U?1.48
B11: R34.1 R35.1 U?1.47
B12: U?1.29 UART1接口.4
B13: U?1.27 UART1接口.3
B14: U?1.30
B15: U?1.28
B16: SPI-无线模块接口.1 屏幕.1
B17: SPI-无线模块接口.5 屏幕.3
B18: U?1.34 屏幕.5
B19: U?1.33 屏幕.7
B20: U?1.36
B21: U?1.35
B22: U?1.38
B23: U?1.37
B24: U?1.40
B25: U?1.39
B26: U?1.42
B27: U?1.41
B28: U?1.46
B29: U?1.45
B30: U?1.43
B31: U?1.44
C0: U?1.82 编码器1-H1.3
C1: U?1.79 编码器1-H1.4
C2: U?1.80 编码器2-H2.3
C3: U?1.77 编码器接口3-H3.3
C4: U?1.78 编码器接口3-H3.4
C5: U?1.75 编码器接口4-H4.3
C6: R22.1 U?1.76
C7: R23.2 U?1.73
C8: R24.1 U?1.74
C9: R25.2 U?1.71
C10: R26.1 U?1.72
C11: R1.2 U?1.69
C12: R33.1 R47.1
C13: R31.1 R46.1
C14: R30.1 R45.1
C15: R21.1 R44.1
C16: U?1.66 UART4接口.4
C17: U?1.63 UART4接口.3
C18: U?1.64 屏幕.16
C19: U?1.61 屏幕.12
C20: U?1.62 姿态传感模块imu.6
C21: U?1.59 姿态传感模块imu.5
C22: U?1.60 姿态传感模块imu.4
C23: U?1.57 姿态传感模块imu.3
C24: U?1.58 编码器2-H2.4
C25: U?1.55 编码器接口4-H4.4
C26: U?1.56
C27: U?1.53
C28: U?1.54
C29: U?1.51
C30: U?1.52
C31: U?1.50
CR: C19.2 R36.2 R37.2 U5.4 U11.3
CSI-3V3: R11.2
D0: U?1.14
D1: U?1.13
D2: R28.1 U?1.12
D3: R29.2 U?1.11
D12: SPI-无线模块接口.8 U?1.15 屏幕.9
D13: SPI-无线模块接口.7 U?1.16 屏幕.11
D14: SPI-无线模块接口.6 U?1.17 屏幕.13
D15: SPI-无线模块接口.10 U?1.18 屏幕.15
D16: U?1.19 串口-无线模块接口.1
D17: U?1.20 串口-无线模块接口.3
D26: U?1.84 串口-无线模块接口.4
D27: R32.1 串口-无线模块接口.8
$1N2592: R24.2 电机驱动信号1-H5.1
$1N2596: R25.1 电机驱动信号1-H5.5
$1N2604: R22.2 电机驱动信号1-H5.2
$1N2608: R23.1 电机驱动信号1-H5.6
$1N2916: R28.2 电机驱动信号2-H6.1
$1N2919: R29.1 电机驱动信号2-H6.5
$1N2922: R26.2 电机驱动信号2-H6.2
$1N2925: R1.1 电机驱动信号2-H6.6
$1N3992: R21.2 SW2.1
$1N3996: R30.2 SW3.1
$1N4004: R31.2 SW4.1
$1N4009: R33.2 SW5.1
$1N4528: LED3-R.2 R10.1
$1N4650: LED4-G.2 R11.1
$1N4783: LED1-G.2 R8.1
$1N4874: LED5-R.2 R12.1
$1N5051: LED2-B.2 R9.1
$1N8072: R38.2 U5.3
$1N10416: R4.2 U7.4
$1N10423: C12.1 U7.1
$1N10427: C12.2 L2.1 U7.8
$1N10446: C20.2 R13.2
$1N10453: R18.2 R27.1 U7.5
$1N10461: R13.1 U7.6
$1N10501: R16.1 R27.2
$1N10556: C13.2 D2.2 L2.2
$1N13494: BUZZER1.1 R17.2
$1N13753: Q2.2 R34.2
$1N13767: BUZZER1.2 Q2.3
$1N14471: D3.K Q3.3 S1.3 电源XT60.2
$1N14655: D3.A R2.1 S1.1
$1N20848: R36.1 R37.1 U?1.9
$1N26305: Q3.2 S1.2

Pads without a net: SCREW1 1; SCREW2 1; SCREW3 1; SCREW4 1; SPI-无线模块接口 9; U11 4; U?1 3 4 7 8 10 21 22 31 32 65 67 68 70 81; 串口-无线模块接口 2; 姿态传感模块imu 7 8; 编码器1-H1 5 6; 编码器2-H2 5 6; 编码器接口3-H3 5 6; 编码器接口4-H4 5 6

## Routing (per net, layer and track width the routed paths; a pad name or vN(x,y) marks a point on that pad's centre or on a via; arc(x,y) is an arc through that point)
$1N14655: length 11.7
  Top Layer w0.254: 13.94,62.33 R2.1
  Top Layer w1.27: 13.94,62.33 7.18,62.33 7.11,62.4 7.08,62.43 D3.A
$1N26305: length 12.3
  Top Layer w1.27: Q3.2 8.68,48.36 9.95,49.63 9.95,55.4 7.75,57.6 7.11,57.6

## Copper pours and planes (outline as drawn; the poured copper is in the pictures)
VCC-5V on Top Layer: 19.55,54.66 22.49,54.66 23.69,53.58 23.69,48.9 25.3,48.9 25.3,53.59 26.49,54.61 30.8,54.61 30.8,55.87 20.27,55.87 20.26,55.88 19.55,55.88
$1N10556 on Top Layer: 25.27,44.01 20.09,44.01 18.5,42.42 16.45,42.42 16.38,42.36 16.38,45.91 25.24,45.91 25.24,44.04
$1N14471 on Top Layer: 4.07,67.44 4.07,66.87 2.1,64.9 2.1,56.01 4.13,53.98 8.07,53.98 8.07,51.82 4.64,51.82 4.64,46.74 1.97,44.07 1.97,36.96 5.02,33.91 8.07,33.91 9.72,32.26 9.72,29.07 8.27,27.63 4.57,27.63 3.24,28.96 3.24,32.39 0.45,35.18 0.45,64.9 2.99,67.44

Small or netless copper shapes (teardrops, artwork), in the pictures only: 1 on Top Layer
